# EAGLE design footswitch (EAGLE 5.11)
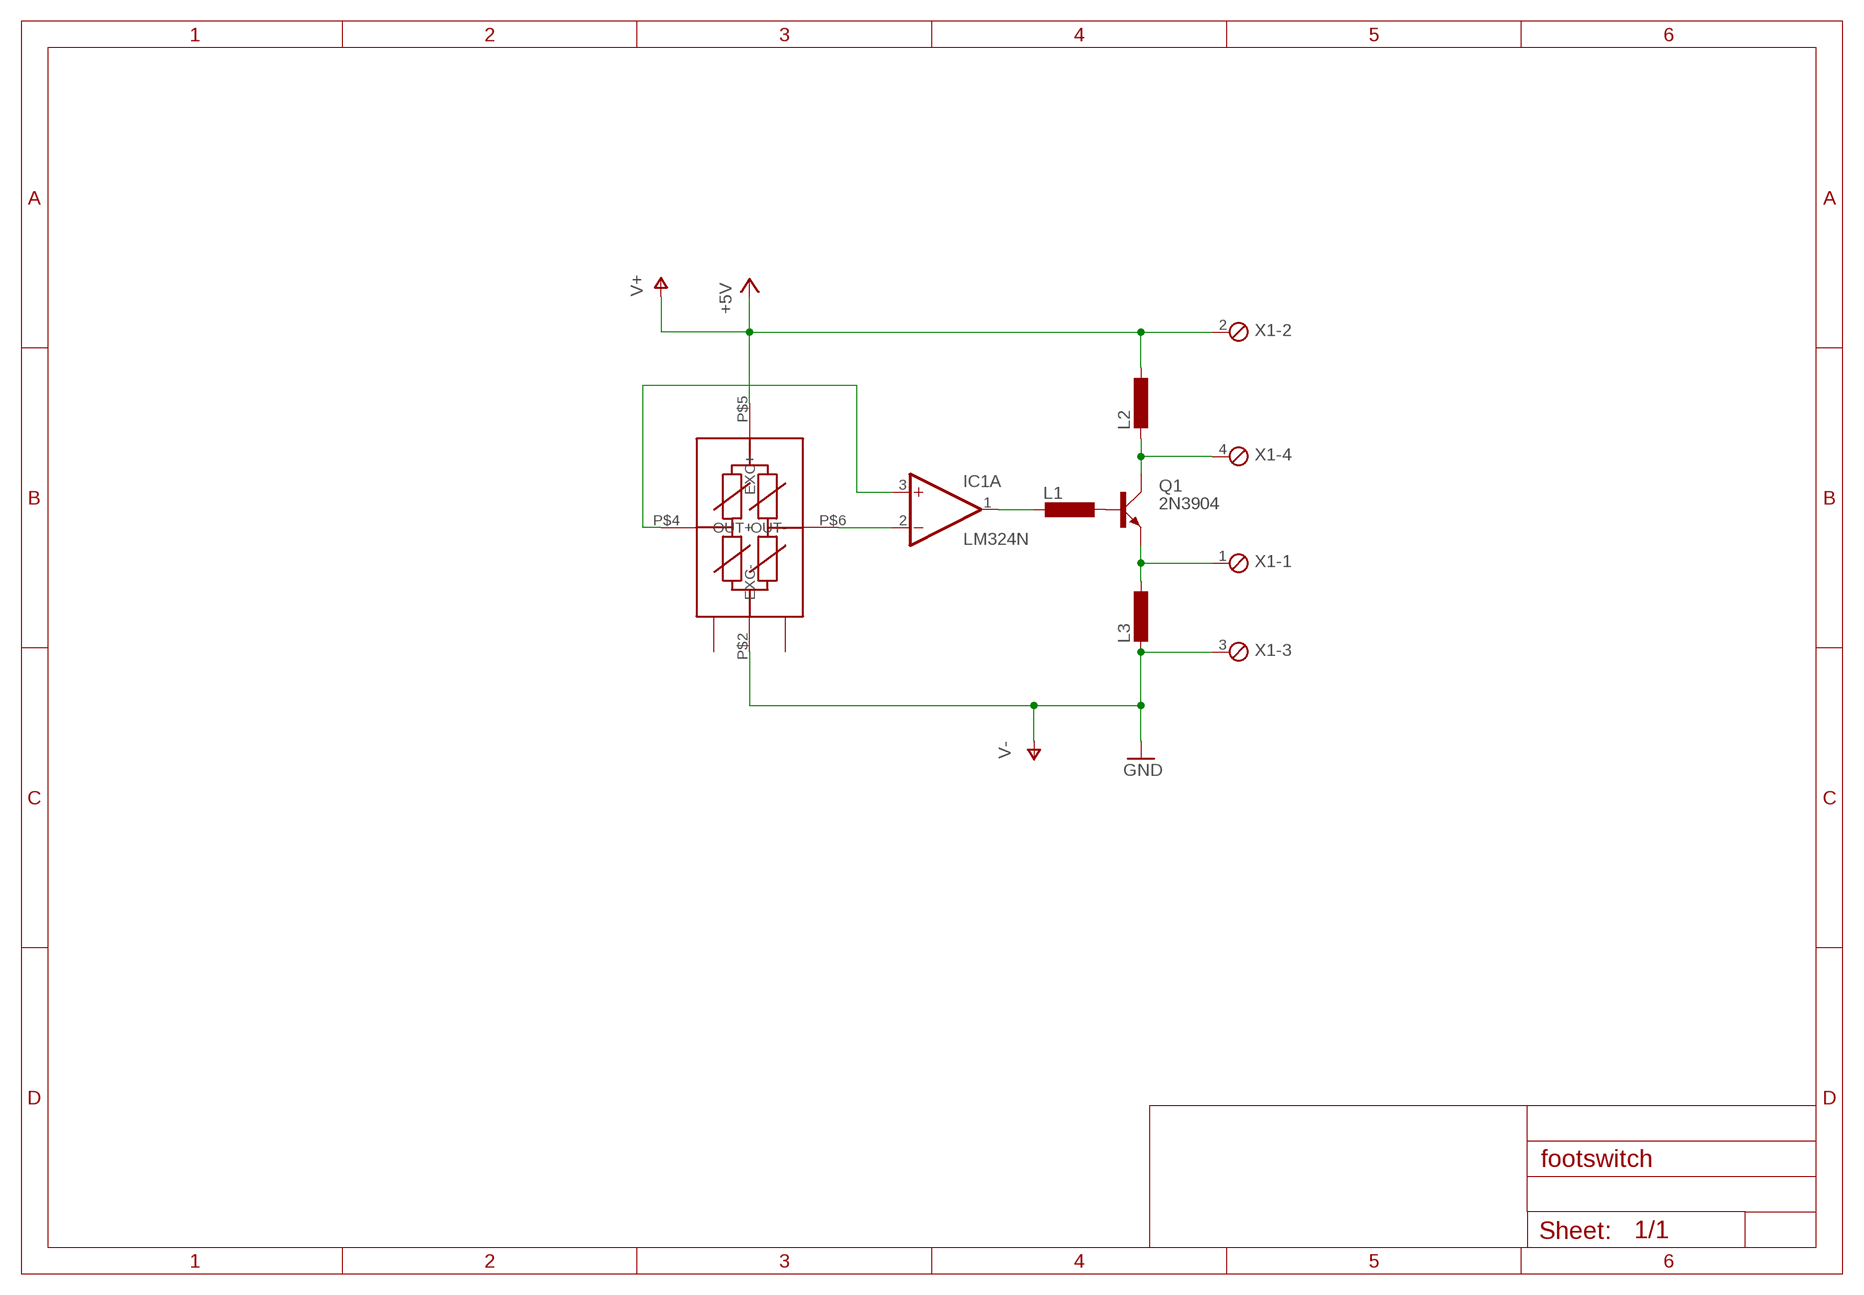
[diagram p0: schematic, sheet 1]

## Parts
IC1  LM324N  [DIL14]
L1  L-EU0207/10  [0207/10]
L2  L-EU0207/10  [0207/10]
L3  L-EU0207/10  [0207/10]
OUT-2  SPD030G  [SPD030G]
Q1  2N3904  [TO92D]
X1  MPT4  [4POL254]

## Nets
N$4: L1.1 Q1.B
N$5: L3.1 Q1.E X1.1
N$6: L2.2 Q1.C X1.4
N$7: IC1.1(A:OUT) L1.2
N$8: IC1.2(A:-IN) OUT-2.P$6(OUT-)
N$9: IC1.3(A:+IN) OUT-2.P$4(OUT+)
V+: L2.1 OUT-2.P$5(EXC+) X1.2 ; supply symbol labelled +5V
V-: L3.2 OUT-2.P$2(EXC-) X1.3 ; supply symbol labelled GND
Unconnected: IC1.5(B:+IN) IC1.6(B:-IN) IC1.7(B:OUT) IC1.8(C:OUT) IC1.9(C:-IN) IC1.10(C:+IN) IC1.12(D:+IN) IC1.13(D:-IN) IC1.14(D:OUT) OUT-2.P$1 OUT-2.P$3

## Power pins joined to a net without a drawn wire
V+: IC1.4(P:V+)
V-: IC1.11(P:V-)

## Library data of the parts
IC1 = linear:LM324: OP AMP
L1-L3 = resistor:L-EU: INDUCTOR, European symbol
OUT-2 = alesko:SPD030G: SPD030G Smart Pressure Device SPD030G. A Dual In Line packages, to accommodate six pins for through-board printed circuit mounting. G is a Gauge type.
Q1 = transistor-small-signal:2N3904: NPN TRANSISTOR
X1 = con-phoenix-254:MPT4: PHOENIX CONNECTOR; OC_FARNELL: unknown; OC_NEWARK: unknown

## Board
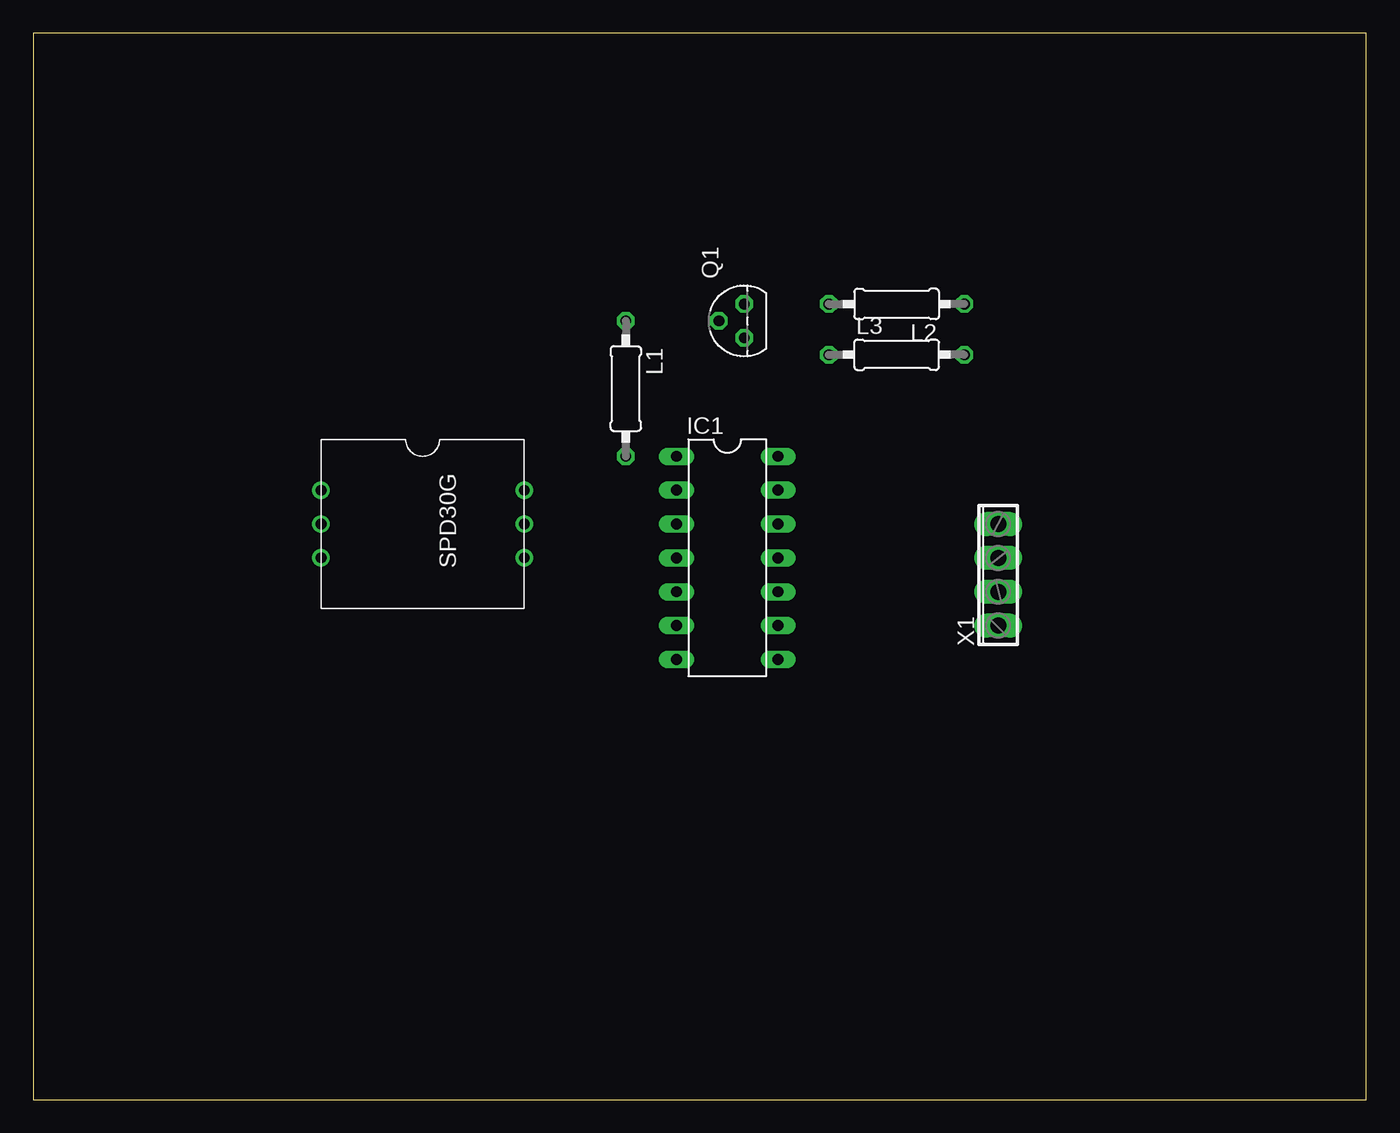
[diagram p1: board, top side]
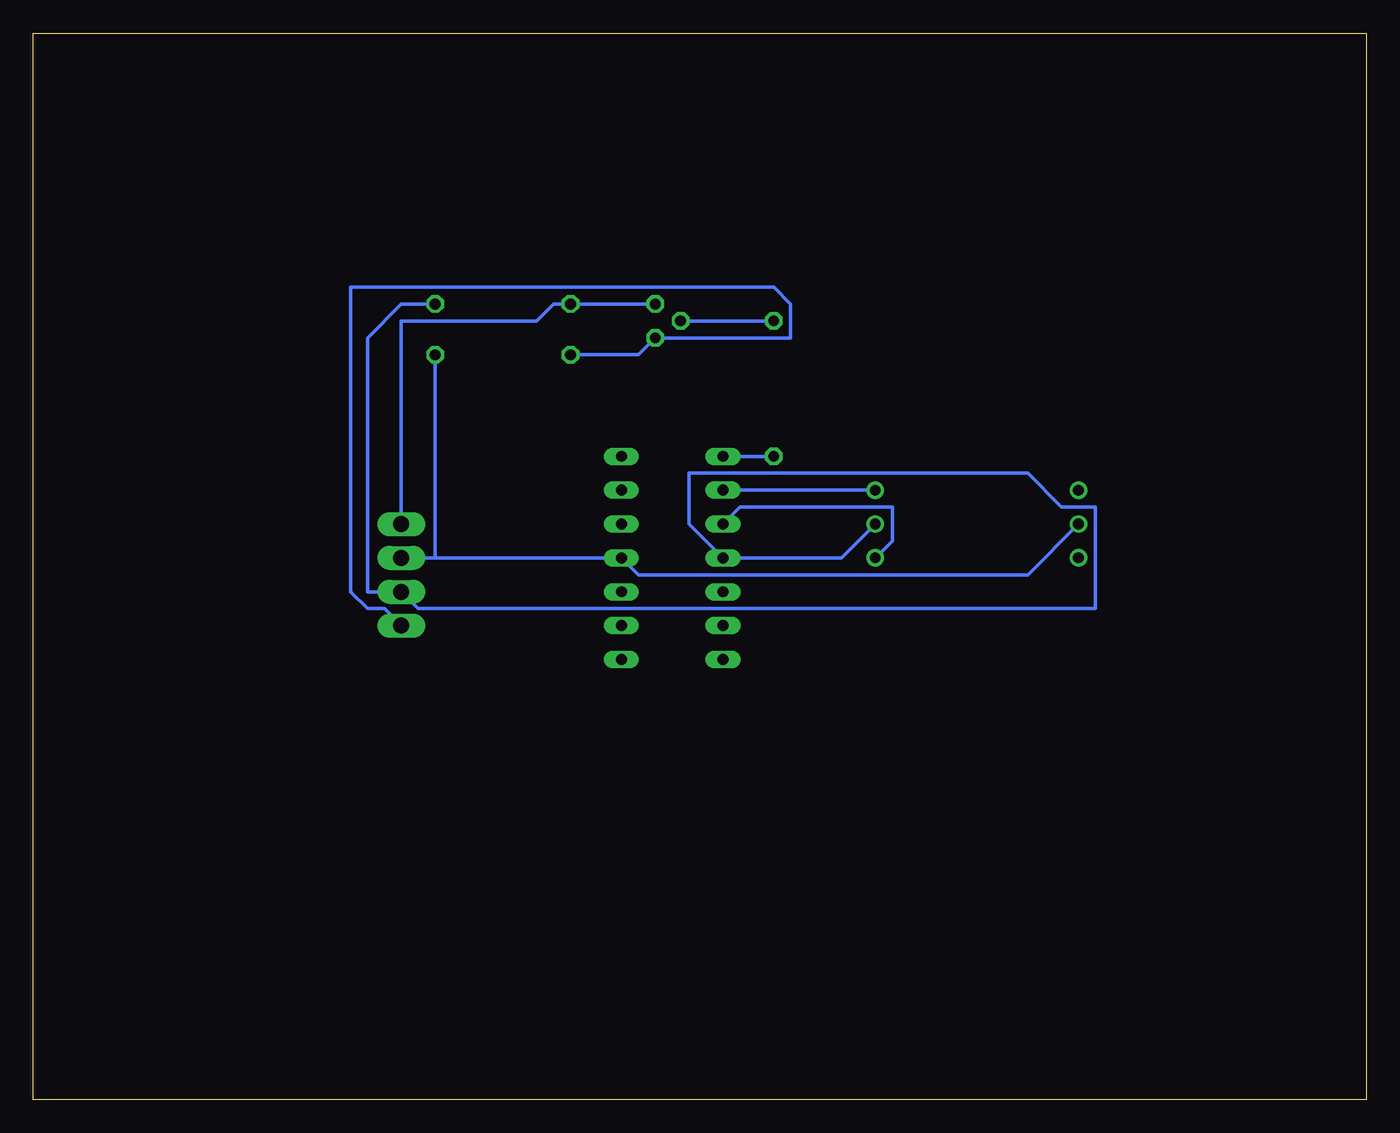
[diagram p2: board, bottom side, seen from below]

Size 100 x 80 mm. Coordinates in mm from the lower left corner, seen from the top.
Outline: 0,0 100,0 100,80 0,80 0,0
Copper layers (1*16): Top 0.035mm / dielectric 1.5mm / Bottom 0.035mm
Design rules "default": minimum track width 10mil, minimum drill 24mil, track to track 8mil, track to pad 8mil, pad to pad 8mil, via to via 8mil, smd to smd 8mil, copper to edge 40mil, drill to drill 8mil, minimum pad ring 10mil, minimum via ring 8mil, stop-mask expansion 4mil, vias tented up to drill 0mil, thermal gap 10mil

### Footprints (pad centres in the part's own frame; a part is rotated, then mirrored left to right if it is on the bottom)
DIL14 = drill 0.813 long: 1 -7.62,-3.81; 2 -5.08,-3.81; 3 -2.54,-3.81; 4 0,-3.81; 5 2.54,-3.81; 6 5.08,-3.81; 7 7.62,-3.81; 8 7.62,3.81; 9 5.08,3.81; 10 2.54,3.81; 11 0,3.81; 12 -2.54,3.81; 13 -5.08,3.81; 14 -7.62,3.81
0207/10 = drill 0.813 octagon: 1 -5.08,0; 2 5.08,0
SPD030G = drill 0.8 round: P$1 -2.54,-7.62; P$2 0,-7.62; P$3 2.54,-7.62; P$4 2.54,7.62; P$5 0,7.62; P$6 -2.54,7.62
TO92D = drill 0.813 octagon: B 0,1.905; C 1.27,0; E -1.27,0
4POL254 = drill 1.2 long: 1 -3.81,0; 2 -1.27,0; 3 1.27,0; 4 3.81,0

### Placement (x,y rotation side)
IC1  52.07,40.64 270 top
L1  44.45,53.34 270 top
L2  64.77,59.69 180 top
L3  64.77,55.88 0 top
OUT-2  29.21,43.18 270 top
Q1  53.34,58.42 90 top
X1  72.39,39.37 90 top

### Tracks (layer width: path | path; a pad name or v marks a point on that pad's centre or on a via)
N$4
  Bottom 0.254: L1.1 Q1.B
N$5
  Bottom 0.254: L3.1 54.61,55.88 Q1.E 43.18,57.15 43.18,59.69 44.45,60.96 76.2,60.96 76.2,38.1 74.93,36.83 73.66,36.83 X1.1
N$6
  Bottom 0.254: Q1.C L2.2 60.96,59.69 62.23,58.42 72.39,58.42 X1.4
N$7
  Bottom 0.254: L1.2 IC1.1
N$8
  Bottom 0.254: OUT-2.P$6 IC1.2
N$9
  Bottom 0.254: OUT-2.P$4 35.56,41.91 35.56,44.45 46.99,44.45 IC1.3
V+
  Bottom 0.254: OUT-2.P$5 39.37,40.64 IC1.4 50.8,43.18 50.8,46.99 25.4,46.99 22.86,44.45 20.32,44.45 20.32,36.83 71.12,36.83 X1.2 74.93,38.1 74.93,57.15 72.39,59.69 L2.1
V-
  Bottom 0.254: 69.85,40.64 L3.2 | 69.85,40.64 X1.3 | OUT-2.P$2 25.4,39.37 54.61,39.37 IC1.11 69.85,40.64